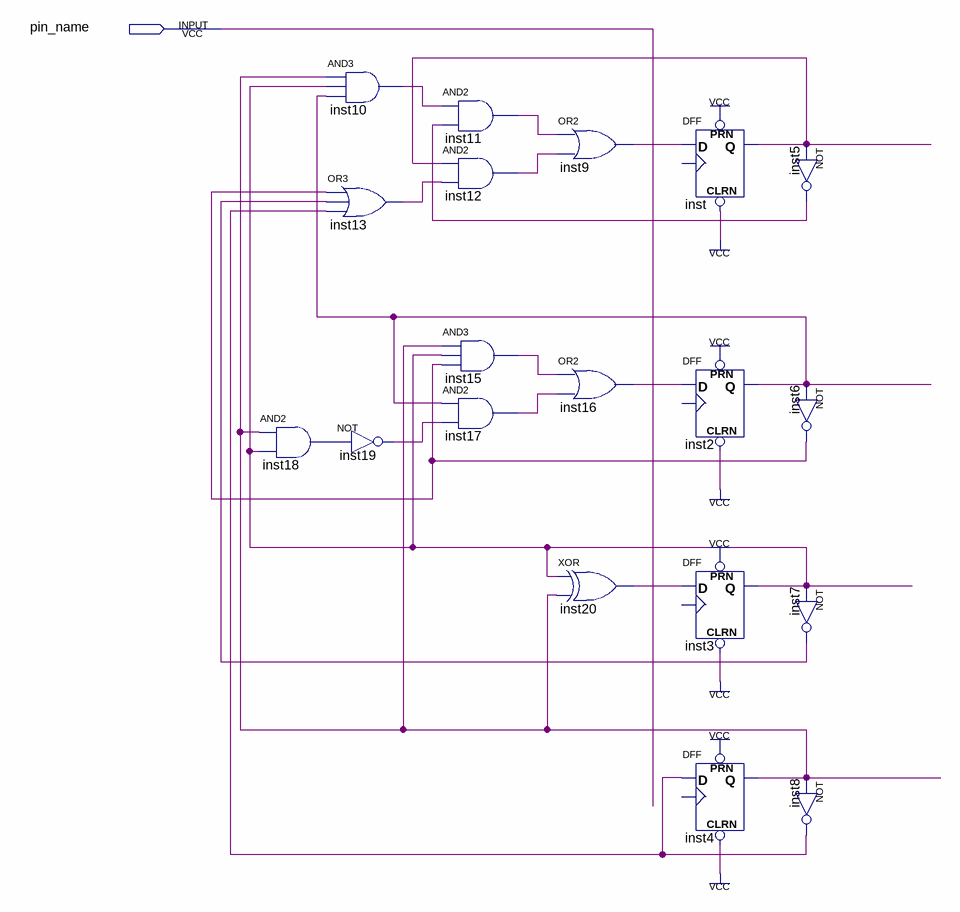
[diagram p0: schematic sheet]
// Quartus schematic readNwriteStateMachine.bdf as structural Verilog: 19 symbols, 1 pins
module readNwriteStateMachine (
  input  pin_name
);

  wire inst2_q, inst3_q, inst4_q, inst5_out, inst6_out, inst7_out, inst8_out, inst9_out, inst10_out,
       inst11_out, inst12_out, inst13_out, inst15_out, inst16_out, inst17_out, inst18_out, inst19_out,
       inst20_out, inst_q;

  and inst18 (inst18_out, inst4_q, inst3_q);
  and inst10 (inst10_out, inst4_q, inst3_q, inst2_q);
  or inst13 (inst13_out, inst6_out, inst7_out, inst8_out);
  not inst19 (inst19_out, inst18_out);
  and inst11 (inst11_out, inst10_out, inst5_out);
  and inst12 (inst12_out, inst_q, inst13_out);
  and inst15 (inst15_out, inst4_q, inst3_q, inst6_out);
  and inst17 (inst17_out, inst2_q, inst19_out);
  or inst9 (inst9_out, inst11_out, inst12_out);
  or inst16 (inst16_out, inst15_out, inst17_out);
  xor inst20 (inst20_out, inst3_q, inst4_q);
  DFF inst (.CLRN(1'b1), .D(inst9_out), .PRN(1'b1), .Q(inst_q));  // open: CLK
  DFF inst2 (.CLRN(1'b1), .D(inst16_out), .PRN(1'b1), .Q(inst2_q));  // open: CLK
  DFF inst3 (.CLRN(1'b1), .D(inst20_out), .PRN(1'b1), .Q(inst3_q));  // open: CLK
  DFF inst4 (.CLRN(1'b1), .D(inst8_out), .PRN(1'b1), .Q(inst4_q));  // open: CLK
  not inst5 (inst5_out, inst_q);
  not inst6 (inst6_out, inst2_q);
  not inst7 (inst7_out, inst3_q);
  not inst8 (inst8_out, inst4_q);
endmodule
